# EAGLE schematic product (EAGLE 6.3)
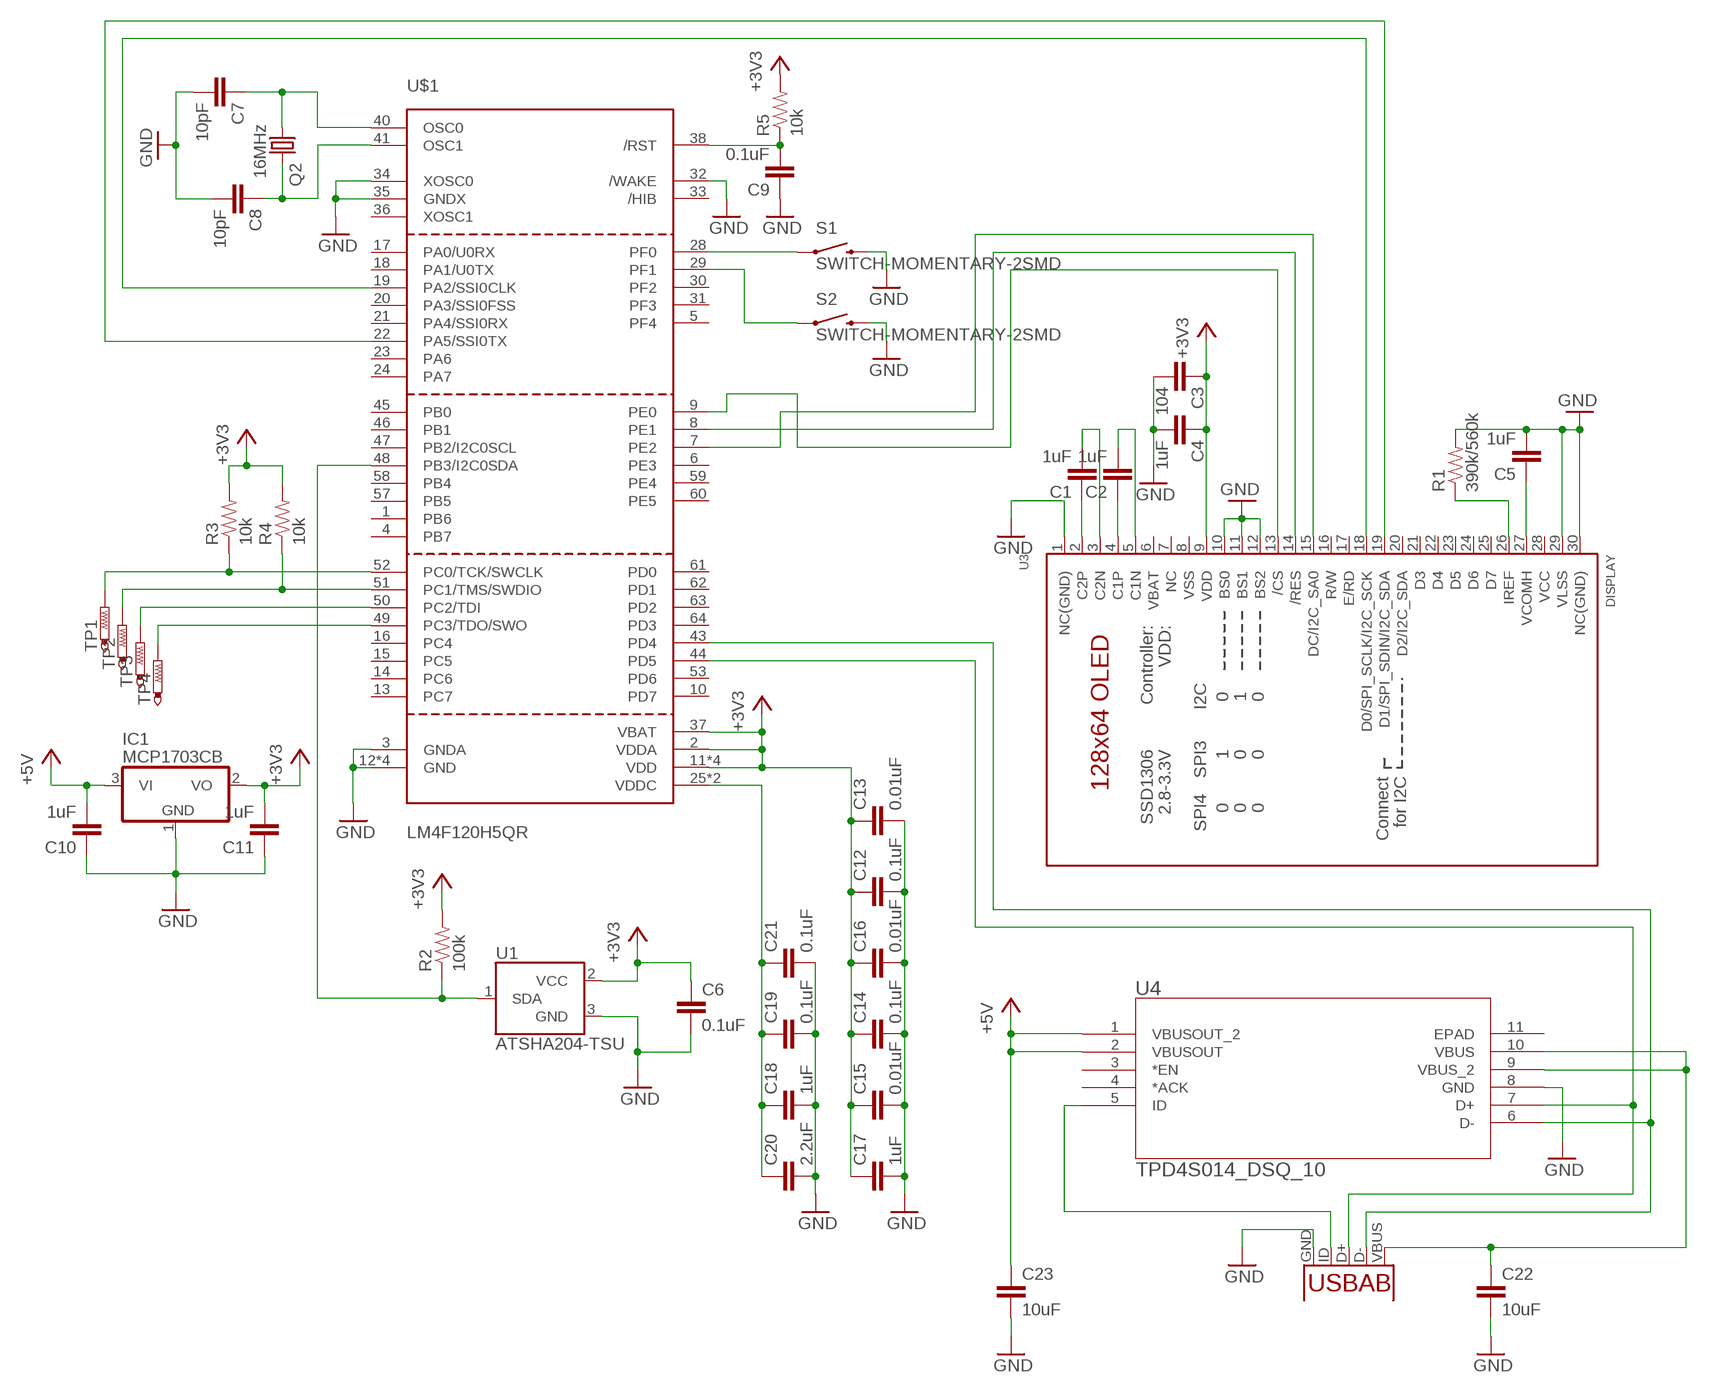
[diagram p0: schematic, sheet 1]

## Parts
C1  1uF  CAP0402-CAP  [0402-CAP]
C2  1uF  CAP0402-CAP  [0402-CAP]
C3  104  CAP0402-CAP  [0402-CAP]
C4  1uF  CAP0402-CAP  [0402-CAP]
C5  1uF  CAP0402-CAP  [0402-CAP]
C6  0.1uF  CAP0402-CAP  [0402-CAP]
C7  10pF  CAP0402-CAP  [0402-CAP]
C8  10pF  CAP0402-CAP  [0402-CAP]
C9  0.1uF  CAP0402-CAP  [0402-CAP]
C10  1uF  CAP0402-CAP  [0402-CAP]
C11  1uF  CAP0402-CAP  [0402-CAP]
C12  0.1uF  CAP0402-CAP  [0402-CAP]
C13  0.01uF  CAP0402-CAP  [0402-CAP]
C14  0.1uF  CAP0402-CAP  [0402-CAP]
C15  0.01uF  CAP0402-CAP  [0402-CAP]
C16  0.01uF  CAP0402-CAP  [0402-CAP]
C17  1uF  CAP0402-CAP  [0402-CAP]
C18  1uF  CAP0402-CAP  [0402-CAP]
C19  0.1uF  CAP0402-CAP  [0402-CAP]
C20  2.2uF  CAP0402-CAP  [0402-CAP]
C21  0.1uF  CAP0402-CAP  [0402-CAP]
C22  10uF  CAP0402-CAP  [0402-CAP]
C23  10uF  CAP0402-CAP  [0402-CAP]
IC1  MCP1703CB  [SOT23]
Q2  16MHz  CRYSTALCTS406  [CTS406]
R1  390k/560k  RESISTOR0402-RES  [0402-RES]
R2  100k  RESISTOR0402-RES  [0402-RES]
R3  10k  RESISTOR0402-RES  [0402-RES]
R4  10k  RESISTOR0402-RES  [0402-RES]
R5  10k  RESISTOR0402-RES  [0402-RES]
S1  SWITCH-MOMENTARY-2SMD  [TACTILE_SWITCH_SMD]
S2  SWITCH-MOMENTARY-2SMD  [TACTILE_SWITCH_SMD]
TP1  PTR1TP10R  [TP10R]
TP2  PTR1TP10R  [TP10R]
TP3  PTR1TP10R  [TP10R]
TP4  PTR1TP10R  [TP10R]
U1  ATSHA204-TSU  [SOT23-3]
U2  USB  USB-AB  [USB-AB-MICRO-SMD]
U3  DISPLAY  DISP_OLED_UG-2864HSWEG010.96"  [UG-2864HSWEG01_0.96IN_WRAPAROUND]
U4  TPD4S014_DSQ_10  [DSQ10_1P5X0P9]
U$1  LM4F120H5QR  [LQFP64]

## Nets
+3V3: C3.1 C4.1 C6.1 C11.2 C12.1 C13.1 C14.1 C15.1 C16.1 C17.1 IC1.2(VO) R2.2 R3.2 R4.2 R5.2 U1.2(VCC) U3.9(VDD) U$1.2(VDDA) U$1.11(VDD) U$1.26(VDD) U$1.37(VBAT) U$1.42(VDD) U$1.54(VDD)
+5V: C10.2 C23.1 IC1.3(VI) U4.1(VBUSOUT_2) U4.2(VBUSOUT)
GND: C3.2 C4.2 C5.2 C6.2 C7.2 C8.2 C9.1 C10.1 C11.1 C12.2 C13.2 C14.2 C15.2 C16.2 C17.2 C18.2 C19.2 C20.2 C21.2 C22.2 C23.2 IC1.1(GND) R1.2 S1.3 S2.3 U1.3(GND) U2.GND U3.1(NC(GND)) U3.10(BS0) U3.11(BS1) U3.12(BS2) U3.29(VLSS) U3.30(NC(GND)) U4.8(GND) U$1.3(GNDA) U$1.12(GND) U$1.27(GND) U$1.32(/WAKE) U$1.34(XOSC0) U$1.35(GNDX) U$1.39(GND) U$1.55(GND)
N$1: U3.19(D1/SPI_SDIN/I2C_SDA) U$1.22(PA5/SSI0TX)
N$2: U3.13(/CS) U$1.9(PE0)
N$3: U2.ID(USBID) U4.5(ID)
N$4: U3.15(DC/I2C_SA0) U$1.7(PE2)
N$5: U3.18(D0/SPI_SCLK/I2C_SCK) U$1.19(PA2/SSI0CLK)
N$6: C5.1 U3.27(VCOMH)
N$7: C22.1 U2.VBUS U4.9(VBUS_2) U4.10(VBUS)
N$8: U3.14(/RES) U$1.8(PE1)
N$9: R1.1 U3.26(IREF)
N$10: C1.1 U3.2(C2P)
N$11: C2.1 U3.4(C1P)
N$12: C1.2 U3.3(C2N)
N$13: C2.2 U3.5(C1N)
N$14: S2.1 U$1.29(PF1)
N$15: S1.1 U$1.28(PF0)
N$16: R4.1 TP2.TP U$1.51(PC1/TMS/SWDIO)
N$17: R3.1 TP1.TP U$1.52(PC0/TCK/SWCLK)
N$19: TP3.TP U$1.50(PC2/TDI)
N$20: TP4.TP U$1.49(PC3/TDO/SWO)
N$21: C9.2 R5.1 U$1.38(/RST)
N$23: C18.1 C19.1 C20.1 C21.1 U$1.25(VDDC) U$1.56(VDDC)
SDA: R2.1 U1.1(SDA) U$1.48(PB3/I2C0SDA)
USB_D_N: U2.D- U4.6(D-) U$1.43(PD4)
USB_D_P: U2.D+ U4.7(D+) U$1.44(PD5)
XTAL1: C7.1 Q2.1 U$1.40(OSC0)
XTAL2: C8.1 Q2.3 U$1.41(OSC1)
Unconnected: U3.6(VBAT) U3.7(NC) U3.16(R/W) U3.17(E/RD) U3.20(D2/I2C_SDA) U3.21(D3) U3.22(D4) U3.23(D5) U3.24(D6) U3.25(D7) U4.3(*EN) U4.4(*ACK) U4.11(EPAD) U$1.1(PB6) U$1.4(PB7) U$1.5(PF4) U$1.6(PE3) U$1.10(PD7) U$1.13(PC7) U$1.14(PC6) U$1.15(PC5) U$1.16(PC4) U$1.17(PA0/U0RX) U$1.18(PA1/U0TX) U$1.20(PA3/SSI0FSS) U$1.21(PA4/SSI0RX) U$1.23(PA6) U$1.24(PA7) U$1.30(PF2) U$1.31(PF3) U$1.33(/HIB) U$1.36(XOSC1) U$1.45(PB0) U$1.46(PB1) U$1.47(PB2/I2C0SCL) U$1.53(PD6) U$1.57(PB5) U$1.58(PB4) U$1.59(PE4) U$1.60(PE5) U$1.61(PD0) U$1.62(PD1) U$1.63(PD2) U$1.64(PD3)

## Power pins joined to a net without a drawn wire
VCC: U3.28(VCC)
VSS: U3.8(VSS)

## Library data of the parts
C1-C23 = SparkFun-Passives:CAP: Capacitor Standard 0603 ceramic capacitor, and 0.1" leaded capacitor.
IC1 = linear:MCP1703: 250 mA, 16V, Low Quiescent Current LDO Regulator Source: http://ww1.microchip.com/downloads/en/DeviceDoc/22049b.pdf
Q2 = crystal:CRYSTAL: CRYSTAL
R1-R5 = SparkFun-Passives:RESISTOR: Resistor Basic schematic elements and footprints for 0603, 1206, and PTH resistors.
S1 S2 = SparkFun-Electromechanical:SWITCH-MOMENTARY-2: Various NO switches- pushbuttons, reed, etc
TP1-TP4 = testpad:PTR1: TEST PIN
U1 = SparkFun-DigitalIC:ATSHA204
U2 = SparkFun-Connectors:USB-AB: This is a USB AB connector that is compatible with USB OTG. i.e. this connector can serve as a host or device
U3 = microbuilder:DISP_OLED_UG-2864HSWEG01: UG-2864HSWEG01 OLED display Both 1.3" and 0.96" models share the same FPC tab footprint, only the screen dimensions vary.
U4 = imported:TPD4S014_DSQ_10
U$1 = stellaris:LM4F120H5QR: LM4F120H5QR Cortex-M4F from the LM4F120 Series.